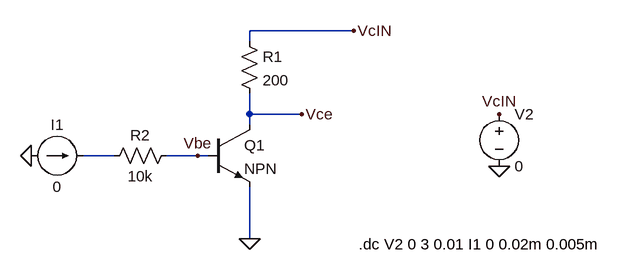
[diagram p0: schematic Experiment1_NPN_Ib.asc]
Experiment1_NPN_Ib.asc, the LTspice schematic file:
Version 4.1
SHEET 1 880 680
WIRE 368 -48 208 -48
WIRE 208 -32 208 -48
WIRE 208 80 208 48
WIRE 288 80 208 80
WIRE 208 96 208 80
WIRE 0 144 -48 144
WIRE 128 144 80 144
WIRE 144 144 128 144
WIRE 208 272 208 192
FLAG 208 272 0
FLAG 368 -48 VcIN
FLAG 128 144 Vbe
FLAG 288 80 Vce
FLAG 592 80 VcIN
FLAG 592 160 0
FLAG -128 144 0
SYMBOL npn 144 96 R0
SYMATTR InstName Q1
SYMBOL res 192 -48 R0
SYMATTR InstName R1
SYMATTR Value 200
SYMBOL res 96 128 R90
WINDOW 0 0 56 VBottom 2
WINDOW 3 32 56 VTop 2
SYMATTR InstName R2
SYMATTR Value 10k
SYMBOL voltage 592 64 R0
WINDOW 123 0 0 Left 0
WINDOW 39 0 0 Left 0
SYMATTR InstName V2
SYMATTR Value 0
SYMBOL current -128 144 R270
WINDOW 0 32 40 VTop 2
WINDOW 3 -32 40 VBottom 2
WINDOW 123 0 0 Left 0
WINDOW 39 0 0 Left 0
SYMATTR InstName I1
SYMATTR Value 0
TEXT 376 280 Left 2 !.dc V2 0 3 0.01 I1 0 0.02m 0.005m

The netlist it stands for:
* Experiment1_NPN_Ib.asc
Q1 Vce Vbe 0 0 NPN
R1 VcIN Vce 200
R2 Vbe N001 10k
V2 VcIN 0 0
I1 0 N001 0
.model NPN NPN
.model PNP PNP
.lib standard.bjt
.dc V2 0 3 0.01 I1 0 0.02m 0.005m
.backanno
.end